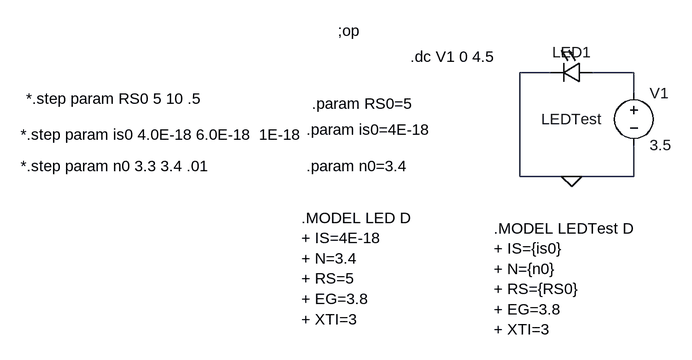
[diagram p0: schematic LED_Test.asc]
LED_Test.asc, the LTspice schematic file:
Version 4
SHEET 1 880 680
WIRE 240 64 192 64
WIRE 368 64 304 64
WIRE 368 96 368 64
WIRE 192 224 192 64
WIRE 272 224 192 224
WIRE 368 224 368 176
WIRE 368 224 272 224
FLAG 272 224 0
SYMBOL voltage 368 80 R0
WINDOW 123 0 0 Left 2
WINDOW 39 0 0 Left 2
SYMATTR InstName V1
SYMATTR Value 3.5
SYMBOL LED 304 48 R90
WINDOW 0 0 32 VBottom 2
WINDOW 3 72 32 VTop 2
SYMATTR InstName LED1
SYMATTR Value LEDTest
TEXT 24 40 Left 2 !.dc V1 0 4.5
TEXT 152 304 Left 2 !.MODEL LEDTest D\n+ IS={is0}\n+ N={n0}\n+ RS={RS0}\n+ EG=3.8\n+ XTI=3
TEXT -568 104 Left 2 !*.step param RS0 5 10 .5
TEXT -576 160 Left 2 !*.step param is0 4.0E-18 6.0E-18  1E-18
TEXT -136 208 Left 2 !.param n0=3.4
TEXT -128 112 Left 2 !.param RS0=5
TEXT -136 152 Left 2 !.param is0=4E-18
TEXT -576 208 Left 2 !*.step param n0 3.3 3.4 .01
TEXT -88 0 Left 2 !;op
TEXT -144 288 Left 2 !.MODEL LED D\n+ IS=4E-18\n+ N=3.4\n+ RS=5\n+ EG=3.8\n+ XTI=3

The netlist it stands for:
* LED_Test.asc
V1 N001 0 3.5
D§LED1 N001 0 LEDTest
.model D D
.lib standard.dio
.dc V1 0 4.5
.MODEL LEDTest D
+ IS={is0}
+ N={n0}
+ RS={RS0}
+ EG=3.8
+ XTI=3
*.step param RS0 5 10 .5
*.step param is0 4.0E-18 6.0E-18  1E-18
.param n0=3.4
.param RS0=5
.param is0=4E-18
*.step param n0 3.3 3.4 .01
;op
.MODEL LED D
+ IS=4E-18
+ N=3.4
+ RS=5
+ EG=3.8
+ XTI=3
.backanno
.end